# EasyEDA Pro project smartmp3.epro

# Schematic Schematic1
Board Name: Board1; Create Date: 2025-09-08; Page Name: P1; Project Name: SmartMP3; Schematic Name: Schematic1; Update Date: 2025-09-20; Company: EasyEDA.com; Page Size: A4; Version: V1.0
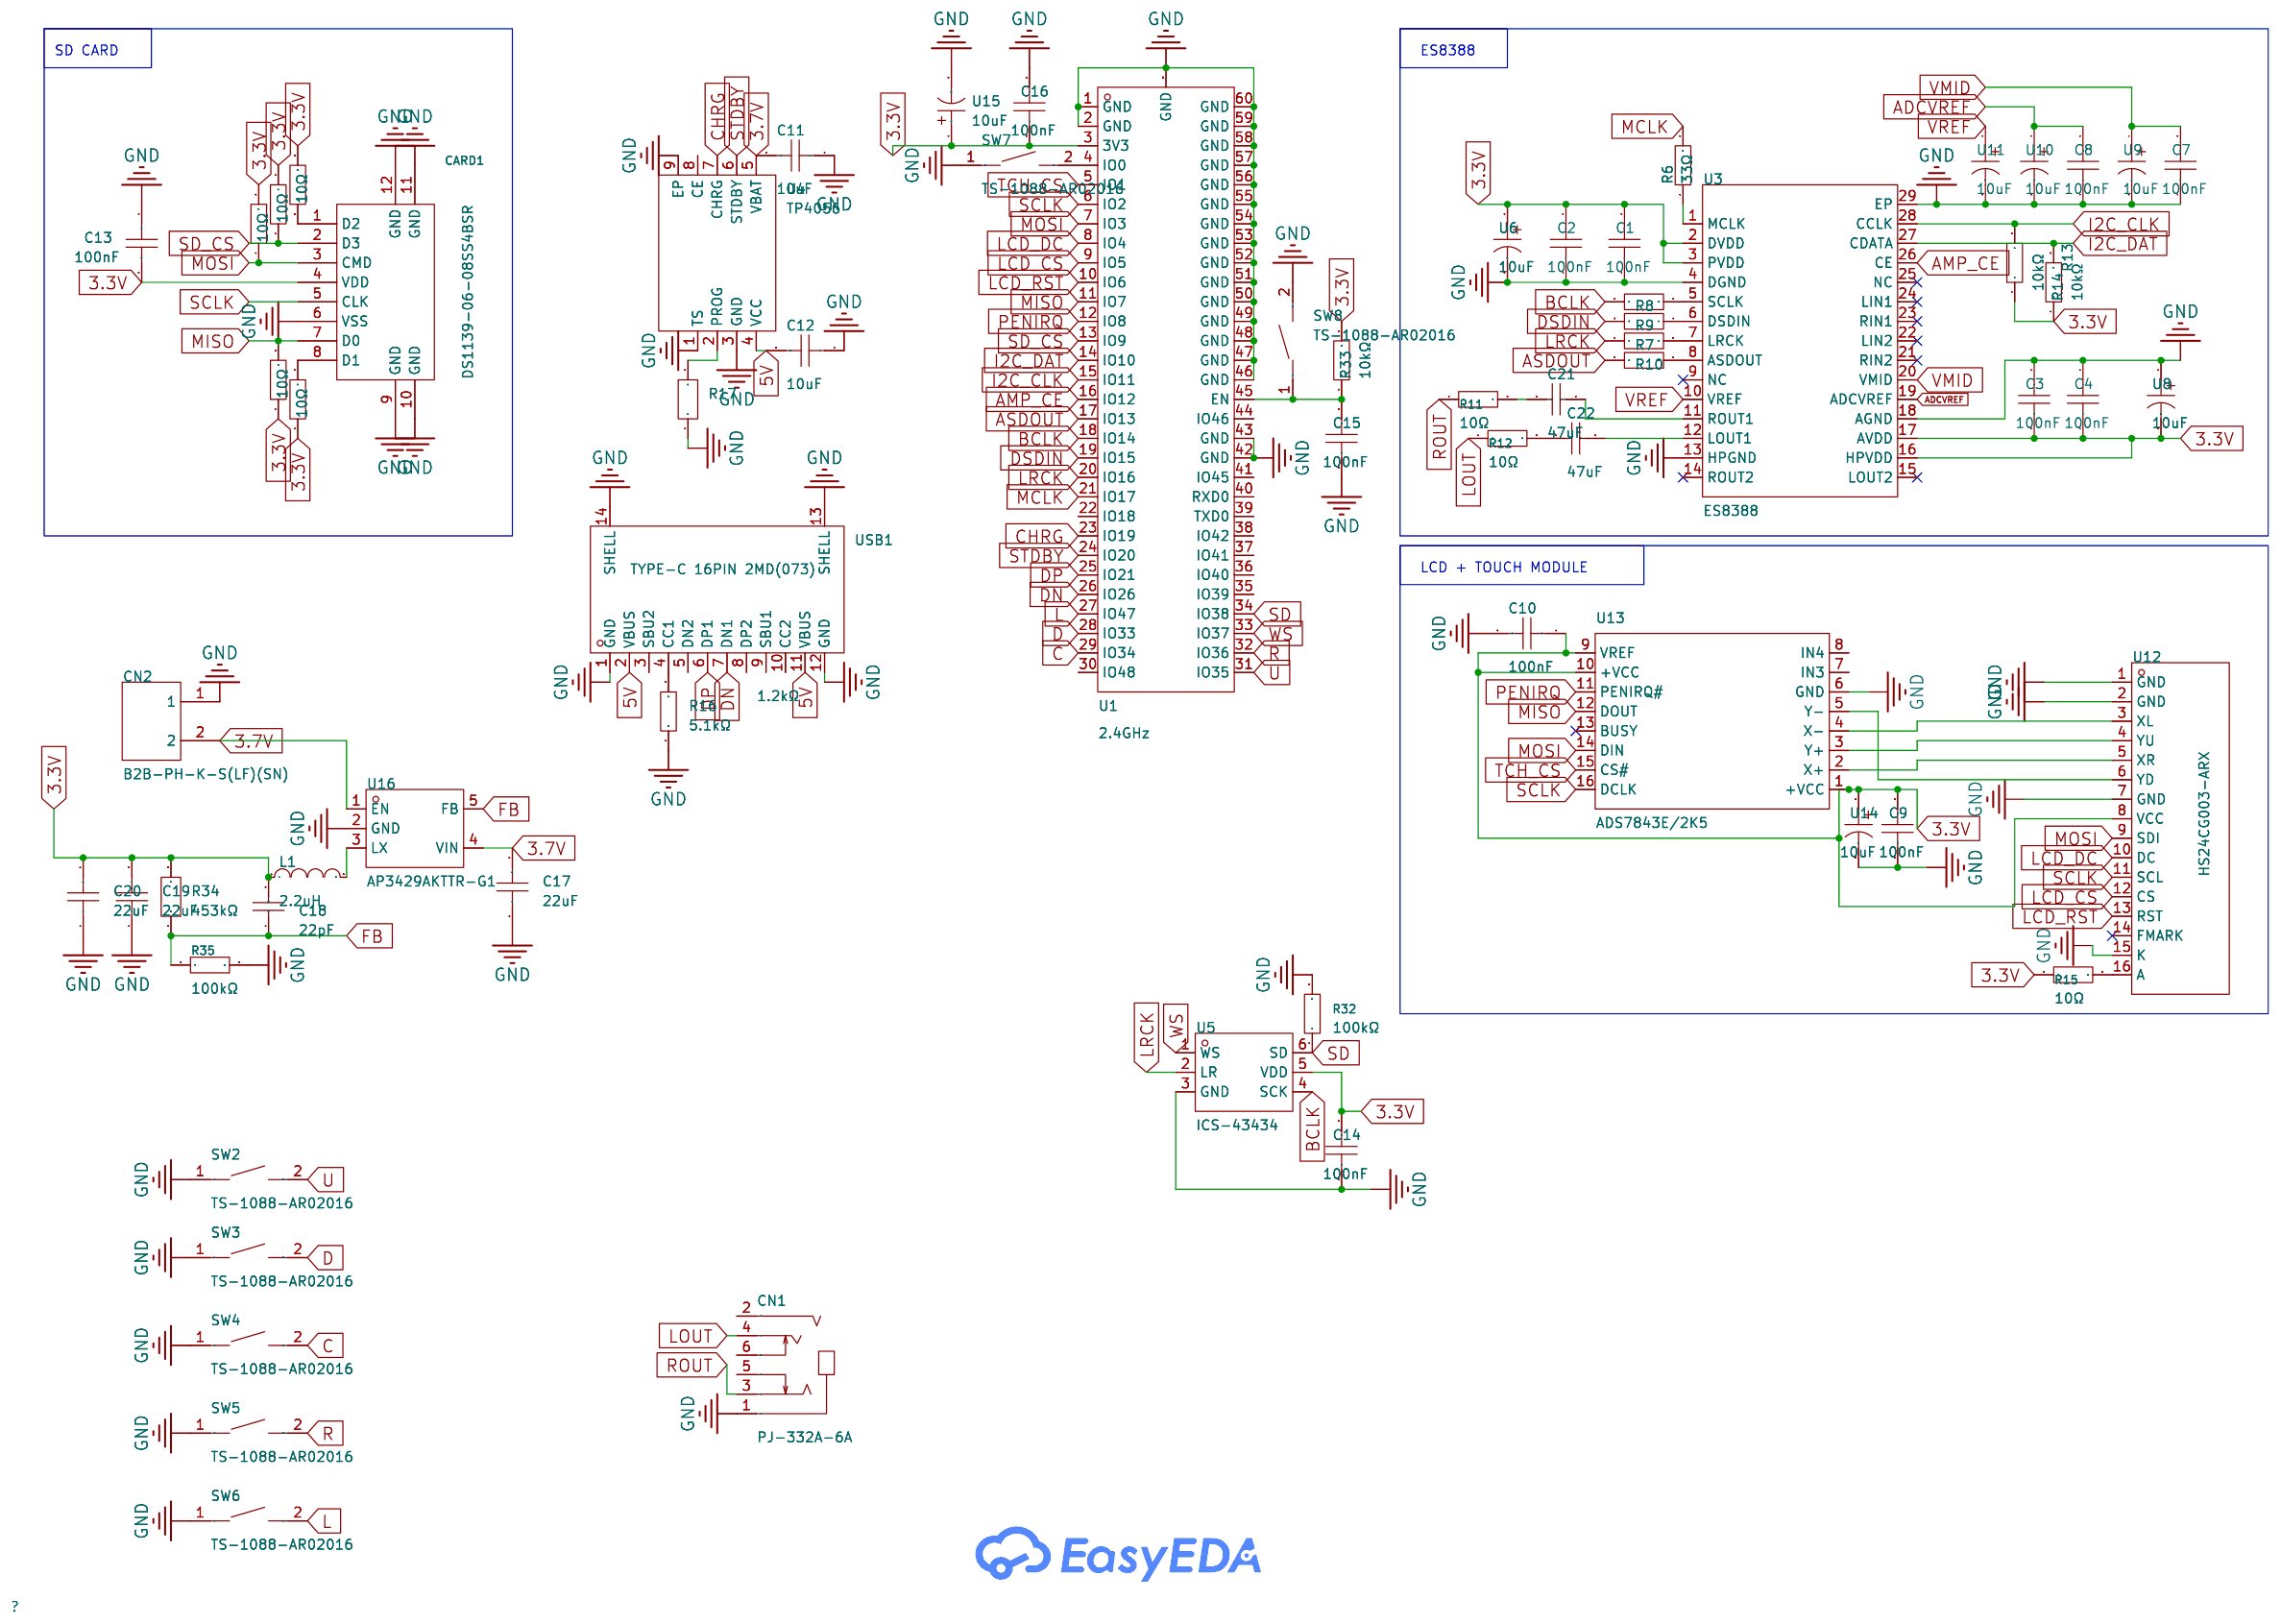
[diagram p0: schematic sheet]

## Parts
C1  100nF  [C0402]
C2  100nF  [C0402]
C3  100nF  [C0402]
C4  100nF  [C0402]
C7  100nF  [C0402]
C8  100nF  [C0402]
C9  100nF  [C0402]
C10  100nF  [C0402]
C11  10uF  [C0805]
C12  10uF  [C0805]
C13  100nF  [C0402]
C14  100nF  [C0402]
C15  100nF  [C0402]
C16  100nF  [C0402]
C17  22uF  [C0805]
C18  22pF  [C0603]
C19  22uF  [C0805]
C20  22uF  [C0805]
C21  47uF  [C0805]
C22  47uF  [C0805]
CARD1  DS1139-06-08SS4BSR  [TF-SMD_DS1139-06-08SS4BSR]
CN1  PJ-332A-6A  [AUDIO-SMD_PJ-332A-6A]
CN2  B2B-PH-K-S(LF)(SN)  [CONN-TH_B2B-PH-K-S]
L1  2.2uH  [L1008]
R6  33Ω  [R0402]
R7  33Ω  [R0402]
R8  33Ω  [R0402]
R9  33Ω  [R0402]
R10  33Ω  [R0402]
R11  10Ω  [R0805_NEW]
R12  10Ω  [R0805_NEW]
R13  10kΩ  [R0603]
R14  10kΩ  [R0603]
R15  10Ω  [R0805_NEW]
R16  5.1kΩ  [R0603]
R17  1.2kΩ  [R1206]
R18  10Ω  [R0805_NEW]
R19  10Ω  [R0805_NEW]
R20  10Ω  [R0805_NEW]
R22  10Ω  [R0805_NEW]
R23  10Ω  [R0805_NEW]
R32  100kΩ  [R0603]
R33  10kΩ  [R0603]
R34  453kΩ  [R0603]
R35  100kΩ  [R0603]
SW2  TS-1088-AR02016  [SW-SMD_L3.9-W3.0-P4.45]
SW3  TS-1088-AR02016  [SW-SMD_L3.9-W3.0-P4.45]
SW4  TS-1088-AR02016  [SW-SMD_L3.9-W3.0-P4.45]
SW5  TS-1088-AR02016  [SW-SMD_L3.9-W3.0-P4.45]
SW6  TS-1088-AR02016  [SW-SMD_L3.9-W3.0-P4.45]
SW7  TS-1088-AR02016  [SW-SMD_L3.9-W3.0-P4.45]
SW8  TS-1088-AR02016  [SW-SMD_L3.9-W3.0-P4.45]
U1  2.4GHz  [BULETM-SMD_ESP32-S3-MINI-1-N8]
U3  ES8388  [QFN-28_L4.0-W4.0-P0.45-BL-EP]
U4  TP4056  [ESOP-8_L4.9-W3.9-P1.27-LS6.0-BL-EP]
U5  ICS-43434  [MIC-SMD_6P-L3.5-W2.7-P0.90-BL]
U6  10uF  [CAP-SMD_BD4.0-L4.3-W4.3-LS5.0-FD]
U8  10uF  [CAP-SMD_BD4.0-L4.3-W4.3-LS5.0-FD]
U9  10uF  [CAP-SMD_BD4.0-L4.3-W4.3-LS5.0-FD]
U10  10uF  [CAP-SMD_BD4.0-L4.3-W4.3-LS5.0-FD]
U11  10uF  [CAP-SMD_BD4.0-L4.3-W4.3-LS5.0-FD]
U12  HS24CG003-ARX  [LCD-SMD_HS24CG003-ARX]
U13  ADS7843E/2K5  [SSOP-16_L4.9-W3.9-P0.64-LS6.0-BL-1]
U14  10uF  [CAP-SMD_BD4.0-L4.3-W4.3-LS5.0-FD]
U15  10uF  [CAP-SMD_BD4.0-L4.3-W4.3-LS5.0-FD]
U16  AP3429AKTTR-G1  [TSOT-23-5_L2.9-W1.6-P0.95-LS2.8-BR]
USB1  TYPE-C 16PIN 2MD(073)  [USB-C-SMD_TYPE-C-6PIN-2MD-073]

## Library data of the parts
C1-C4 C7-C10 C13-C16 = CT41G-0402-2X1-16V-0.1μF-K(N): Capacitance:100nF Tolerance:±10% Tolerance:±10% Voltage Rating:16V Temperature Coefficient:-; LCSC Part Name: 100nF ±10% 16V; Supplier Part: C141382; Manufacturer: TORCH(火炬); Supplier Footprint: 0402; JLCPCB Part Class: Extended Part; Datasheet: https://item.szlcsc.com/datasheet/CT41G-0402-2X1-16V-0.1%25CE%25BCF-K(N)/152712.html; Supplier: LCSC; Tolerance: ±10%; Voltage Rating: 16V
C11 C12 = CL21A106KAYNNNE_C15850: Capacitance:10uF Tolerance:±10% Tolerance:±10% Voltage Rating:25V Temperature Coefficient:X5R; LCSC Part Name: 10uF ±10% 25V; Supplier Part: C15850; Manufacturer: SAMSUNG(三星); Manufacturer Part: CL21A106KAYNNNE; Supplier Footprint: 0805; JLCPCB Part Class: Basic Part; Datasheet: https://item.szlcsc.com/datasheet/CL21A106KAYNNNE/16532.html; Supplier: LCSC; Tolerance: ±10%; Voltage Rating: 25V; Temperature Coefficient: X5R
C17 C19 C20 = CL21A226MAYNNNE: Capacitance:22uF Tolerance:±20% Tolerance:±20% Voltage Rating:25V Temperature Coefficient:X5R; LCSC Part Name: 22uF ±20% 25V; Supplier Part: C602037; Manufacturer: SAMSUNG(三星); Supplier Footprint: 0805; JLCPCB Part Class: Extended Part; Datasheet: https://item.szlcsc.com/datasheet/CL21A226MAYNNNE/631473.html; Supplier: LCSC; Tolerance: ±20%; Voltage Rating: 25V; Temperature Coefficient: X5R
C18 = CL10C220JB8NNNC: Capacitance:22pF Tolerance:±5% Tolerance:±5% Voltage Rating:50V Temperature Coefficient:C0G; LCSC Part Name: 22pF ±5% 50V; Supplier Part: C1653; Manufacturer: SAMSUNG(三星); Supplier Footprint: 0603; JLCPCB Part Class: Basic Part; Datasheet: https://item.szlcsc.com/datasheet/CL10C220JB8NNNC/2005.html; Supplier: LCSC; Tolerance: ±5%; Voltage Rating: 50V; Temperature Coefficient: C0G
C21 C22 = CL21A476MQYNNNE: Capacitance:47uF Tolerance:±20% Tolerance:±20% Voltage Rating:6.3V Temperature Coefficient:X5R; LCSC Part Name: 47uF ±20% 6.3V; Supplier Part: C16780; Manufacturer: SAMSUNG(三星); Supplier Footprint: 0805; JLCPCB Part Class: Basic Part; Datasheet: https://item.szlcsc.com/datasheet/CL21A476MQYNNNE/17464.html; Supplier: LCSC; Tolerance: ±20%; Voltage Rating: 6.3V; Temperature Coefficient: X5R
CARD1 = DS1139-06-08SS4BSR: Card Connection Mode:Clamshell Card Type:MicroSD卡(TF卡) Connector Type:Deck Maximum Body Height:- Contact Material:- Contact Plating:- Operating Temperature Range:- Operating Temperature Range:- Soldering Temperature(Max):-; LCSC Part Name: 翻盖式 MicroSD卡(TF卡) 卡座; Supplier Part: C86574; Manufacturer: CONNFLY; Supplier Footprint: SMD; JLCPCB Part Class: Extended Part; Datasheet: https://atta.szlcsc.com/upload/public/pdf/source/20161105/1478330339773.pdf; Supplier: LCSC; Card Connection Mode: Clamshell; Card Type: MicroSD卡(TF卡); Connector Type: Deck
CN1 = PJ-332A-6A: Connector Type:3.5mm Headphone Jack Current Rating:1A Voltage Rating (Max):30V Operating Temperature:-25℃~+80℃ Operating Temperature:-25℃~+80℃; LCSC Part Name: 3.5mm耳机座; Supplier Part: C2848643; Manufacturer: 韩国韩荣; Supplier Footprint: SMD; JLCPCB Part Class: Extended Part; Datasheet: https://item.szlcsc.com/datasheet/PJ-332A-6A/3047164.html; Supplier: LCSC; Connector Type: 3.5mm Headphone Jack; Current Rating: 1A; Voltage Rating (Max): 30V; Operating Temperature: -25℃~+80℃
CN2 = B2B-PH-K-S(LF)(SN): Pins Structure:1x2P Pitch:2mm Mounting Type:Direct Insert Reference Series:PH Number of Pins:2P Number of Rows:1 Number of PINs Per Row:2 Row Spacing:- Current Rating:2A Contact Material:Brass Contact Plating:Tin Operating Temperature:-25℃~+85℃ Operating; LCSC Part Name: 1x2P 间距:2mm 直插 系列:PH; Supplier Part: C131337; Manufacturer: JST; Supplier Footprint: 插件,P=2mm; JLCPCB Part Class: Extended Part; Datasheet: https://atta.szlcsc.com/upload/public/pdf/source/20171026/C131342_15089839687311058815.pdf; Supplier: LCSC; Pins Structure: 1x2P; Pitch: 2mm; Mounting Type: Direct Insert; Reference Series: PH; Number of Pins: 2P; Number of Rows: 1; Number of PINs Per Row: 2; Current Rating: 2A; Contact Material: Brass; Contact Plating: Tin; Operating Temperature: -25℃~+85℃; Voltage Rating: 100V; Plastic Material: PA66; Flame Retardant Rating: UL94V-0; Supplementary Features: K-leg punch; Color: White; Z-Height of the Board: 6mm; X-Length of Bottom Edge on Board (Spacing Line): 5.9mm; Y-Width of Bottom Edge on Board: 4.5mm
L1 = LQM2HPN2R2MG0L: Inductance:2.2uH Tolerance:±20% Tolerance:±20% Current Rating:1.3A Current - Saturation (Isat):- DC Resistance(DCR):100mΩ Q @ Frequency:- Frequency - Self Resonant:40MHz Ratings:-; LCSC Part Name: 2.2uH ±20%; Supplier Part: C86092; Manufacturer: muRata(村田); Supplier Footprint: 1008; JLCPCB Part Class: Extended Part; Datasheet: https://item.szlcsc.com/datasheet/LQM2HPN2R2MG0L/87268.html; Supplier: LCSC; Tolerance: ±20%; Current Rating: 1.3A; DC Resistance(DCR): 100mΩ; Frequency - Self Resonant: 40MHz
R6-R10 = RC0402FR-0733RL: Type:Thick Film Resistor Resistance:33Ω Tolerance:±1% Tolerance:±1% Power(Watts):62.5mW Voltage-Supply(Max):50V Temperature Coefficient:±100ppm/℃ Temperature Coefficient:±100ppm/℃ Operating Temperature:-55℃~+155℃ Operating Temperature:-55℃~+155℃; LCSC Part Name: 厚膜电阻 33Ω ±1% 62.5mW; Supplier Part: C138002; Manufacturer: YAGEO(国巨); Supplier Footprint: 0402; JLCPCB Part Class: Extended Part; Datasheet: https://atta.szlcsc.com/upload/public/pdf/source/20250610/89E4D743C004A82A45145C7A2CC3A578.pdf; Supplier: LCSC; Type: Thick Film Resistor; Tolerance: ±1%; Power(Watts): 62.5mW; Voltage-Supply(Max): 50V; Temperature Coefficient: ±100ppm/℃; Operating Temperature: -55℃~+155℃
R11 R12 R15 R18-R20 R22 R23 = 0805W8F100JT5E: Type:Thick Film Resistor Resistance:10Ω Tolerance:±1% Tolerance:±1% Power(Watts):125mW Voltage-Supply(Max):150V Temperature Coefficient:±200ppm/℃ Temperature Coefficient:±200ppm/℃ Operating Temperature:-55℃~+155℃ Operating Temperature:-55℃~+155℃; LCSC Part Name: 10Ω ±1% 125mW 厚膜电阻; Supplier Part: C17415; Manufacturer: UNI-ROYAL(厚声); Supplier Footprint: 0805; JLCPCB Part Class: Basic Part; Datasheet: https://item.szlcsc.com/datasheet/0805W8F100JT5E/18103.html; Supplier: LCSC; Type: Thick Film Resistor; Tolerance: ±1%; Power(Watts): 125mW; Voltage-Supply(Max): 150V; Temperature Coefficient: ±200ppm/℃; Operating Temperature: -55℃~+155℃
R13 R14 R33 = RC0603FR-0710KL: Type:Thick Film Resistors Resistance: Tolerance:±1% Tolerance:±1% Power(Watts): Overload Voltage (Max): Temperature Coefficient:±100ppm/℃ Temperature Coefficient:±100ppm/℃ Operating Temperature Range:-55℃~+155℃ Operating Temperature Range:-55℃~+155℃; LCSC Part Name: 厚膜电阻 10kΩ ±1% 100mW; Supplier Part: C98220; Manufacturer: YAGEO(国巨); Supplier Footprint: 0603; JLCPCB Part Class: Extended Part; Datasheet: https://atta.szlcsc.com/upload/public/pdf/source/20180927/C295883_E8D83085EA81BD7DE0B2B681138C15EE.pdf; Supplier: LCSC; Type: Thick Film Resistors; Tolerance: ±1%; Temperature Coefficient: ±100ppm/℃; Operating Temperature Range: -55℃~+155℃
R16 = RC0603FR-075K1L: Type:Thick Film Resistors Resistance:5.1kΩ Tolerance:±1% Tolerance:±1% Power(Watts):100mW Voltage-Supply(Max):75V Temperature Coefficient:±100ppm/℃ Temperature Coefficient:±100ppm/℃ Operating Temperature:-55℃~+155℃ Operating Temperature:-55℃~+155℃; LCSC Part Name: 厚膜电阻 5.1kΩ ±1% 100mW; Supplier Part: C105580; Manufacturer: YAGEO(国巨); Supplier Footprint: 0603; JLCPCB Part Class: Extended Part; Datasheet: https://atta.szlcsc.com/upload/public/pdf/source/20180316/70C0E2BDAE7FCC62C531A5A58D202EE1.pdf; Supplier: LCSC; Type: Thick Film Resistors; Tolerance: ±1%; Power(Watts): 100mW; Voltage-Supply(Max): 75V; Temperature Coefficient: ±100ppm/℃; Operating Temperature: -55℃~+155℃
R17 = FRC1206J122 TS: Type:Thick Film Resistor Resistance:1.2kΩ Tolerance:±5% Tolerance:±5% Power(Watts):250mW Voltage-Supply(Max):200V Temperature Coefficient:±100ppm/℃ Temperature Coefficient:±100ppm/℃ Operating Temperature:-55℃~+155℃ Operating Temperature:-55℃~+155℃; LCSC Part Name: 1.2kΩ ±5% 250mW 厚膜电阻; Supplier Part: C2907408; Manufacturer: FOJAN(富捷); Supplier Footprint: 1206; JLCPCB Part Class: Extended Part; Supplier: LCSC; Type: Thick Film Resistor; Tolerance: ±5%; Power(Watts): 250mW; Voltage-Supply(Max): 200V; Temperature Coefficient: ±100ppm/℃; Operating Temperature: -55℃~+155℃
R32 R35 = RC0603FR-07100KL: Type:Thick Film Resistors Resistance: Tolerance:±1% Tolerance:±1% Power(Watts): Overload Voltage (Max): Temperature Coefficient:±100ppm/℃ Temperature Coefficient:±100ppm/℃ Operating Temperature Range:-55℃~+155℃ Operating Temperature Range:-55℃~+155℃; LCSC Part Name: 厚膜电阻 100kΩ ±1% 100mW; Supplier Part: C14675; Manufacturer: YAGEO(国巨); Supplier Footprint: 0603; JLCPCB Part Class: Extended Part; Datasheet: https://atta.szlcsc.com/upload/public/pdf/source/20140324/1457707028752.pdf; Supplier: LCSC; Type: Thick Film Resistors; Tolerance: ±1%; Temperature Coefficient: ±100ppm/℃; Operating Temperature Range: -55℃~+155℃
R34 = FRC0603F4533TS: Type:Thick Film Resistor Resistance:453kΩ Tolerance:±1% Tolerance:±1% Power(Watts):100mW Voltage-Supply(Max):75V Temperature Coefficient:±100ppm/℃ Temperature Coefficient:±100ppm/℃ Operating Temperature:-55℃~+155℃ Operating Temperature:-55℃~+155℃; LCSC Part Name: 453kΩ ±1% 100mW 厚膜电阻; Supplier Part: C3013202; Manufacturer: FOJAN(富捷); Supplier Footprint: 0603; JLCPCB Part Class: Extended Part; Supplier: LCSC; Type: Thick Film Resistor; Tolerance: ±1%; Power(Watts): 100mW; Voltage-Supply(Max): 75V; Temperature Coefficient: ±100ppm/℃; Operating Temperature: -55℃~+155℃
SW2-SW8 = TS-1088-AR02016: Circuit:SPST Actuator Style:Round Button Operating Force:1.6N Mounting Type:Surface Mount,Vertical Length:4mm Width:3mm Switch Height:2mm with Bracket:Without Bracket Contact Current:50mA Voltage Rating:12V Actuator/Cap Color:Black Termination Style:SMD(S; LCSC Part Name: 4*3*2mm 立贴 轻触开关; Supplier Part: C720477; Manufacturer: XUNPU(讯普); Supplier Footprint: SMD; JLCPCB Part Class: Basic Part; Datasheet: https://item.szlcsc.com/datasheet/TS-1088-AR02016/763484.html; Supplier: LCSC; Circuit: SPST; Actuator Style: Round Button; Operating Force: 1.6N; Mounting Type: Surface Mount,Vertical; Length: 4mm; Width: 3mm; Switch Height: 2mm; with Bracket: Without Bracket; Contact Current: 50mA; Voltage Rating: 12V; Actuator/Cap Color: Black; Termination Style: SMD(SMT) Tab; Life: 100,000 Cycles; Operating Temperature: -30℃~+80℃
U1 = ESP32-S3-MINI-1-N8: Core Processor:ESP32-S3FN8 Chip Wireless Standard:- Support Interface:I2C；GPIO；SPI；PWM；ADC；UART；USB；I2S Frequency:2.4GHz Antenna Type:- Output Power:20.5dBm Output Power:20.5dBm Operating Voltage:- Operating Voltage:- Receive  Current:- Send  Current:- Se; Supplier Part: C2913206; Manufacturer: ESPRESSIF(乐鑫); Supplier Footprint: SMD; JLCPCB Part Class: Extended Part; Datasheet: https://atta.szlcsc.com/upload/public/pdf/source/20220425/7F117D7A09F85946280540FD9EFDF9F3.pdf; Supplier: LCSC; Core Processor: ESP32-S3FN8 Chip; Support Interface: I2C；GPIO；SPI；PWM；ADC；UART；USB；I2S; Output Power: 20.5dBm
U3 = ES8388: Voltage - Supply:1.7V~3.6V Voltage - Supply:1.7V~3.6V Interface Type:SPI；I2C; LCSC Part Name: 音频解码芯片; Supplier Part: C365736; Manufacturer: Everest-semi(顺芯); Supplier Footprint: QFN-28-EP(4x4); JLCPCB Part Class: Extended Part; Datasheet: https://item.szlcsc.com/datasheet/ES8388/339918.html; Supplier: LCSC; Voltage - Supply: 1.7V~3.6V; Interface Type: SPI；I2C
U4 = TP4056_C22470410: The Chip Type:Linear charging chip Voltage - Supply:4.5V~5.5V Voltage - Supply:4.5V~5.5V Charge Current - Max:1000mA Charging Saturation Voltage:4.2V End-Off Voltage:- Type of Battery:Lithium-ion/Polymer Number of Cells:1 Number of Cells:1 Operating Tempe; Supplier Part: C22470410; Manufacturer: JSMSEMI(杰盛微); Supplier Footprint: ESOP-8; JLCPCB Part Class: Extended Part; Datasheet: https://atta.szlcsc.com/upload/public/pdf/source/20240625/CEC2C0E539B944633666A6FB842D3E54.pdf; Supplier: LCSC; The Chip Type: Linear charging chip; Voltage - Supply: 4.5V~5.5V; Charge Current - Max: 1000mA; Charging Saturation Voltage: 4.2V; Type of Battery: Lithium-ion/Polymer; Number of Cells: 1; Operating Temperature: -40℃~+85℃
U5 = ICS-43434_C5656610: Direction:Omnidirectional Voltage - Supply:1.65V~3.63V Voltage - Supply:1.65V~3.63V Current Consumption:550uA Current Consumption:550uA S/N Ratio:64dB Sensitivity:- Sensitivity:-; Supplier Part: C5656610; Manufacturer: TDK InvenSense(应美盛); JLCPCB Part Class: Extended Part; Datasheet: https://item.szlcsc.com/datasheet/ICS-43434/6577565.html; Supplier: LCSC; Direction: Omnidirectional; Voltage - Supply: 1.65V~3.63V; Current Consumption: 550uA; S/N Ratio: 64dB
U6 U8-U11 U14 U15 = RST10UF35V015: Capacitance:10uF Tolerance:±20% Tolerance:±20% Voltage Rating:35V Ripple Current:15mA@120Hz Equivalent Series Resistance(ESR):- Diameter:4mm Height - Seated (Max):5.4mm Lifetime:2000hrs@105℃ Operating Temperature:-40℃~+105℃ Operating Temperature:-40℃~+105; LCSC Part Name: 10uF ±20% 35V; Supplier Part: C4747970; Manufacturer: KNSCHA(科尼盛); Supplier Footprint: SMD,D4xL5.4mm; JLCPCB Part Class: Extended Part; Datasheet: https://atta.szlcsc.com/upload/public/pdf/source/20220722/B4E523E3F12606FCEEF875CFA41EF963.pdf; Supplier: LCSC; Tolerance: ±20%; Voltage Rating: 35V; Ripple Current: 15mA@120Hz; Diameter: 4mm; Height - Seated (Max): 5.4mm; Lifetime: 2000hrs@105℃; Operating Temperature: -40℃~+105℃
U12 = HS24CG003-ARX: Controller Type:ST7789 Size:2.4 Dot Pixels:320x240 Operating Temperature:-20℃~+70℃ Operating Temperature:-20℃~+70℃; LCSC Part Name: 2.4寸240*320(RGB)彩色SPI串口TFT液晶显示屏; Supplier Part: C5329583; Manufacturer: HS(汉昇); JLCPCB Part Class: Extended Part; Datasheet: https://atta.szlcsc.com/upload/public/pdf/source/20240419/92734CF61D9EC5DBF692D2DF9BCAC008.pdf; Supplier: LCSC; Controller Type: ST7789; Size: 2.4; Dot Pixels: 320x240; Operating Temperature: -20℃~+70℃
U13 = ADS7843E/2K5: Touch Screen Type:4 Wire Resistive Type Resolution (Bits):12Bit Interface:SPI Gain Error:±2LSB Gain Error:±2LSB Voltage - Supply:2.7V~5V Voltage - Supply:2.7V~5V Throughput Rate:125kHz Operating Temperature:-40℃~+85℃ Operating Temperature:-40℃~+85℃; LCSC Part Name: ADS7843 触摸屏控制器; Supplier Part: C364888; Manufacturer: TI(德州仪器); Supplier Footprint: SSOP-16-150mil; JLCPCB Part Class: Extended Part; Datasheet: https://www.ti.com/cn/lit/gpn/ads7843; Supplier: LCSC; Touch Screen Type: 4 Wire Resistive Type; Resolution (Bits): 12Bit; Interface: SPI; Gain Error: ±2LSB; Voltage - Supply: 2.7V~5V; Throughput Rate: 125kHz; Operating Temperature: -40℃~+85℃
U16 = AP3429AKTTR-G1: Function:Step-down type Output Type:Adjustable Input Voltage:2.7V~5.5V Input Voltage:2.7V~5.5V Output Voltage:- Output Voltage:- Output Current:2A Switching Frequency:1MHz Switching Frequency:1MHz Operating Temperature:-40℃~+85℃ Operating Temperature:-40℃; LCSC Part Name: 1.0MHz, 2A 降压 DC-DC 转换器; Supplier Part: C441814; Manufacturer: DIODES(美台); Supplier Footprint: TSOT-25-5; JLCPCB Part Class: Extended Part; Datasheet: https://atta.szlcsc.com/upload/public/pdf/source/20191028/C441814_E5644AF8F55DD7901E677693E39C2B16.pdf; Supplier: LCSC; Function: Step-down type; Output Type: Adjustable; Input Voltage: 2.7V~5.5V; Output Current: 2A; Switching Frequency: 1MHz; Operating Temperature: -40℃~+85℃; Synchronous Rectification: Yes; Number of Outputs: 1; Topology: Step-down; Quiescent Current (Iq): 90uA; Switch tube (built-in/external): Built-in
USB1 = TYPE-C 16PIN 2MD(073): Connector Type:Type-C Protocol Standard:- Gender:Female Mounting Type:Surface Mount, Right Angle Number of Contacts:16P Number of Ports:1 Current Rating-Power:3A Voltage Rating:5V Connect-Disconnect Life:5,000 Cycles Supplementary Features:- Center Height; LCSC Part Name: Type-C 母 卧贴; Supplier Part: C2765186; Manufacturer: SHOU HAN(首韩); Supplier Footprint: SMD; JLCPCB Part Class: Extended Part; Datasheet: https://item.szlcsc.com/datasheet/TYPE-C%252016PIN%25202MD(073)/2901843.html; Supplier: LCSC; Connector Type: Type-C; Gender: Female; Mounting Type: Surface Mount, Right Angle; Number of Contacts: 16P; Number of Ports: 1; Current Rating-Power: 3A; Voltage Rating: 5V; Connect-Disconnect Life: 5,000 Cycles; Detection color: Black; Operating Temperature: -25℃~+85℃

## Nets
3.3V: C1.2 C2.2 C3.1 C4.1 C9.2 C10.1 C13.2 C14.2 C16.1 C18.2 C19.2 C20.2 CARD1.4(VDD) L1.1 R13.1 R14.1 R15.1 R18.2 R19.2 R20.2 R22.1 R23.1 R33.2 R34.2 U1.3(3V3) U3.2(DVDD) U3.3(PVDD) U3.16(HPVDD) U3.17(AVDD) U5.5(VDD) U6.1 U8.2 U12.8(VCC) U13.1(+VCC) U13.9(VREF) U13.10(+VCC) U14.1 U15.1
3.7V: C11.2 C17.2 CN2.2 U4.5(VBAT) U16.1(EN) U16.4(VIN)
5V: C12.2 U4.4(VCC) USB1.2(VBUS) USB1.11(VBUS)
GND: C1.1 C2.1 C3.2 C4.2 C7.1 C8.1 C9.1 C10.2 C11.1 C12.1 C13.1 C14.1 C15.1 C16.2 C17.1 C19.1 C20.1 CARD1.6(VSS) CARD1.9(GND) CARD1.10(GND) CARD1.11(GND) CARD1.12(GND) CN1.1 CN2.1 R16.1 R17.1 R32.2 R35.2 SW2.1 SW3.1 SW4.1 SW5.1 SW6.1 SW7.1 SW8.2 U1.1(GND) U1.2(GND) U1.42(GND) U1.43(GND) U1.46(GND) U1.47(GND) U1.48(GND) U1.49(GND) U1.50(GND) U1.51(GND) U1.52(GND) U1.53(GND) U1.54(GND) U1.55(GND) U1.56(GND) U1.57(GND) U1.58(GND) U1.59(GND) U1.60(GND) U1.GND U3.4(DGND) U3.13(HPGND) U3.18(AGND) U3.29(EP) U4.1(TS) U4.3(GND) U4.9(EP) U5.3(GND) U6.2 U8.1 U9.2 U10.2 U11.2 U12.1(GND) U12.2(GND) U12.7(GND) U12.15(K) U13.6(GND) U14.2 U15.2 U16.2(GND) USB1.1(GND) USB1.12(GND) USB1.13(SHELL) USB1.14(SHELL)
ADCVREF: C8.2 U3.19(ADCVREF) U10.1
AMP_CE: U1.16(IO12) U3.26(CE)
ASDOUT: R10.2 U1.17(IO13)
BCLK: R8.2 U1.18(IO14) U5.4(SCK)
C: SW4.2 U1.29(IO34)
CHRG: U1.23(IO19) U4.7(CHRG)
D: SW3.2 U1.28(IO33)
DN: U1.26(IO26) USB1.7(DN1)
DP: U1.25(IO21) USB1.6(DP1)
DSDIN: R9.2 U1.19(IO15)
FB: C18.1 R34.1 R35.1 U16.5(FB)
I2C_CLK: R13.2 U1.15(IO11) U3.28(CCLK)
I2C_DAT: R14.2 U1.14(IO10) U3.27(CDATA)
L: SW6.2 U1.27(IO47)
LCD_CS: U1.9(IO5) U12.12(CS)
LCD_DC: U1.8(IO4) U12.10(DC)
LCD_RST: U1.10(IO6) U12.13(RST)
LOUT: CN1.4 R12.1
LRCK: R7.1 U1.20(IO16) U5.2(LR)
MCLK: R6.2 U1.21(IO17)
MISO: CARD1.7(D0) R22.2 U1.11(IO7) U13.12(DOUT)
MOSI: CARD1.3(CMD) R18.1 U1.7(IO3) U12.9(SDI) U13.14(DIN)
PENIRQ: U1.12(IO8) U13.11(PENIRQ#)
R: SW5.2 U1.32(IO36)
ROUT: CN1.3 R11.1
SCLK: CARD1.5(CLK) U1.6(IO2) U12.11(SCL) U13.16(DCLK)
SD: R32.1 U1.34(IO38) U5.6(SD)
SD_CS: CARD1.2(D3) R19.1 U1.13(IO9)
STDBY: U1.24(IO20) U4.6(STDBY)
TCH_CS: U1.5(IO1) U13.15(CS#)
U: SW2.2 U1.31(IO35)
VMID: C7.2 U3.20(VMID) U9.1
VREF: U3.10(VREF) U11.1
WS: U1.33(IO37) U5.1(WS)
$1N3464: R6.1 U3.1(MCLK)
$1N3611: R7.2 U3.7(LRCK)
$1N3650: R8.1 U3.5(SCLK)
$1N3734: R9.1 U3.6(DSDIN)
$1N3736: R10.1 U3.8(ASDOUT)
$1N3967: C21.2 U3.11(ROUT1)
$1N4008: C22.2 U3.12(LOUT1)
$1N4170: C21.1 R11.2
$1N6804: U12.6(YD) U13.5(Y-)
$1N6810: U12.3(XL) U13.4(X-)
$1N6817: U12.4(YU) U13.3(Y+)
$1N6824: U12.5(XR) U13.2(X+)
$1N7337: R15.2 U12.16(A)
$1N7731: R16.2 USB1.4(CC1)
$1N8164: R17.2 U4.2(PROG)
$1N10270: CARD1.1(D2) R20.1
$1N10384: CARD1.8(D1) R23.2
$1N17107: L1.2 U16.3(LX)
$1N20602: C22.1 R12.2
Net-(C15-2): C15.2 R33.1 SW8.1 U1.45(EN)
Net-(SW7-2): SW7.2 U1.4(IO0)

Not connected (* = marked no-connect by the designer): CN1 2 5 6; U1 22(IO18) 30(IO48) 35(IO39) 36(IO40) 37(IO41) 38(IO42) 39(TXD0) 40(RXD0) 41(IO45) 44(IO46); U3 9(NC)* 14(ROUT2)* 15(LOUT2)* 21(RIN2)* 22(LIN2)* 23(RIN1)* 24(LIN1)* 25(NC)*; U4 8(CE); U12 14(FMARK)*; U13 7(IN3) 8(IN4) 13(BUSY)*; USB1 3(SBU2) 5(DN2) 8(DP2) 9(SBU1) 10(CC2)

## Notes on the sheet
- SD CARD
- ES8388
- LCD + TOUCH MODULE

# Board PCB1
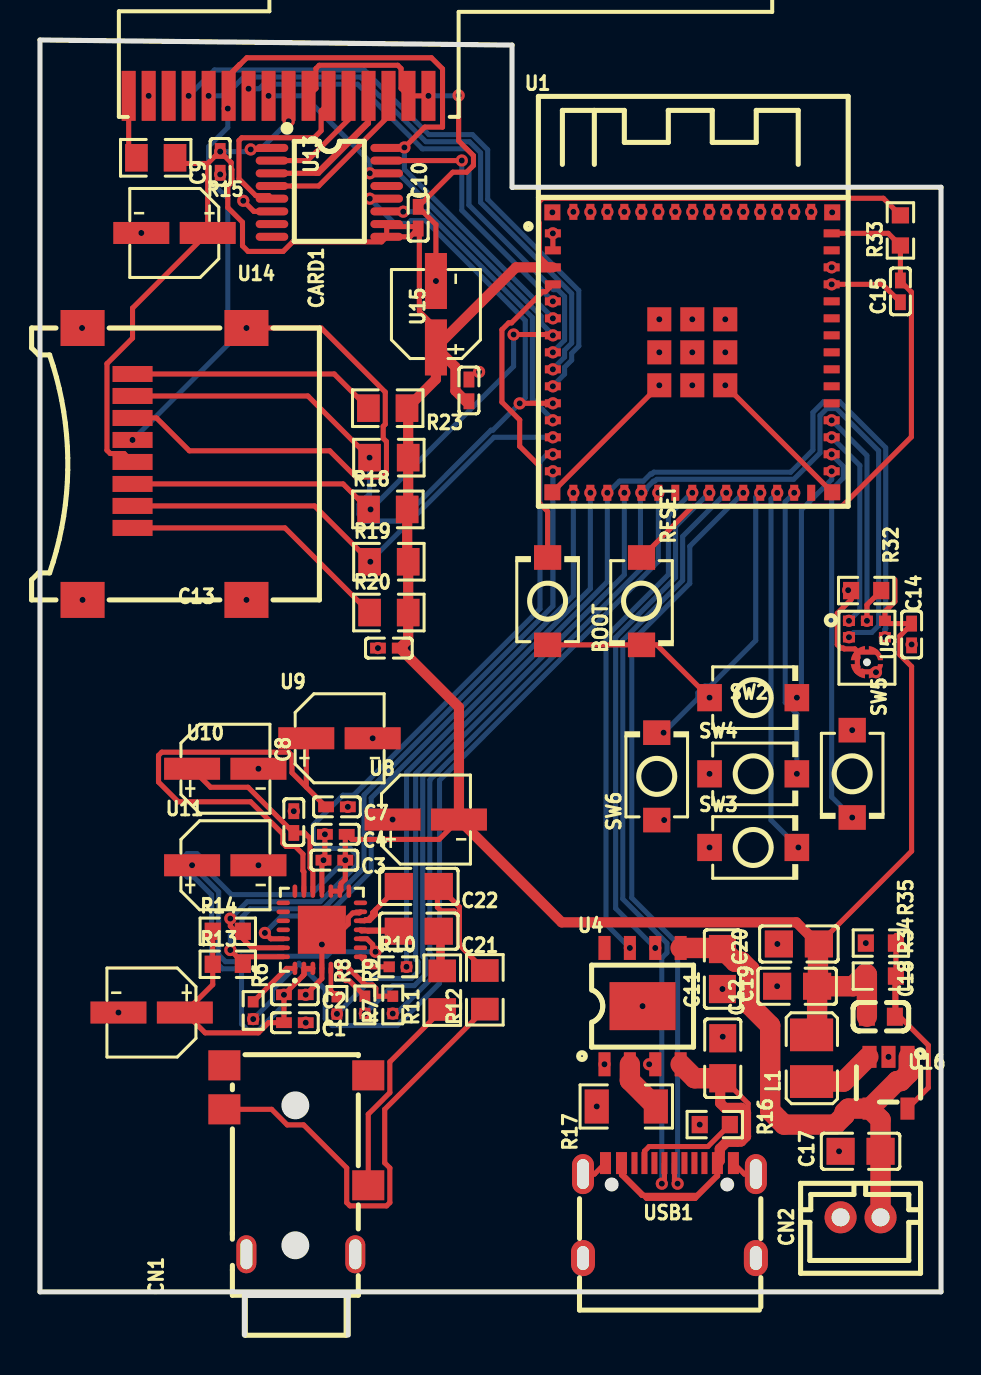
[diagram p1: board, top side]
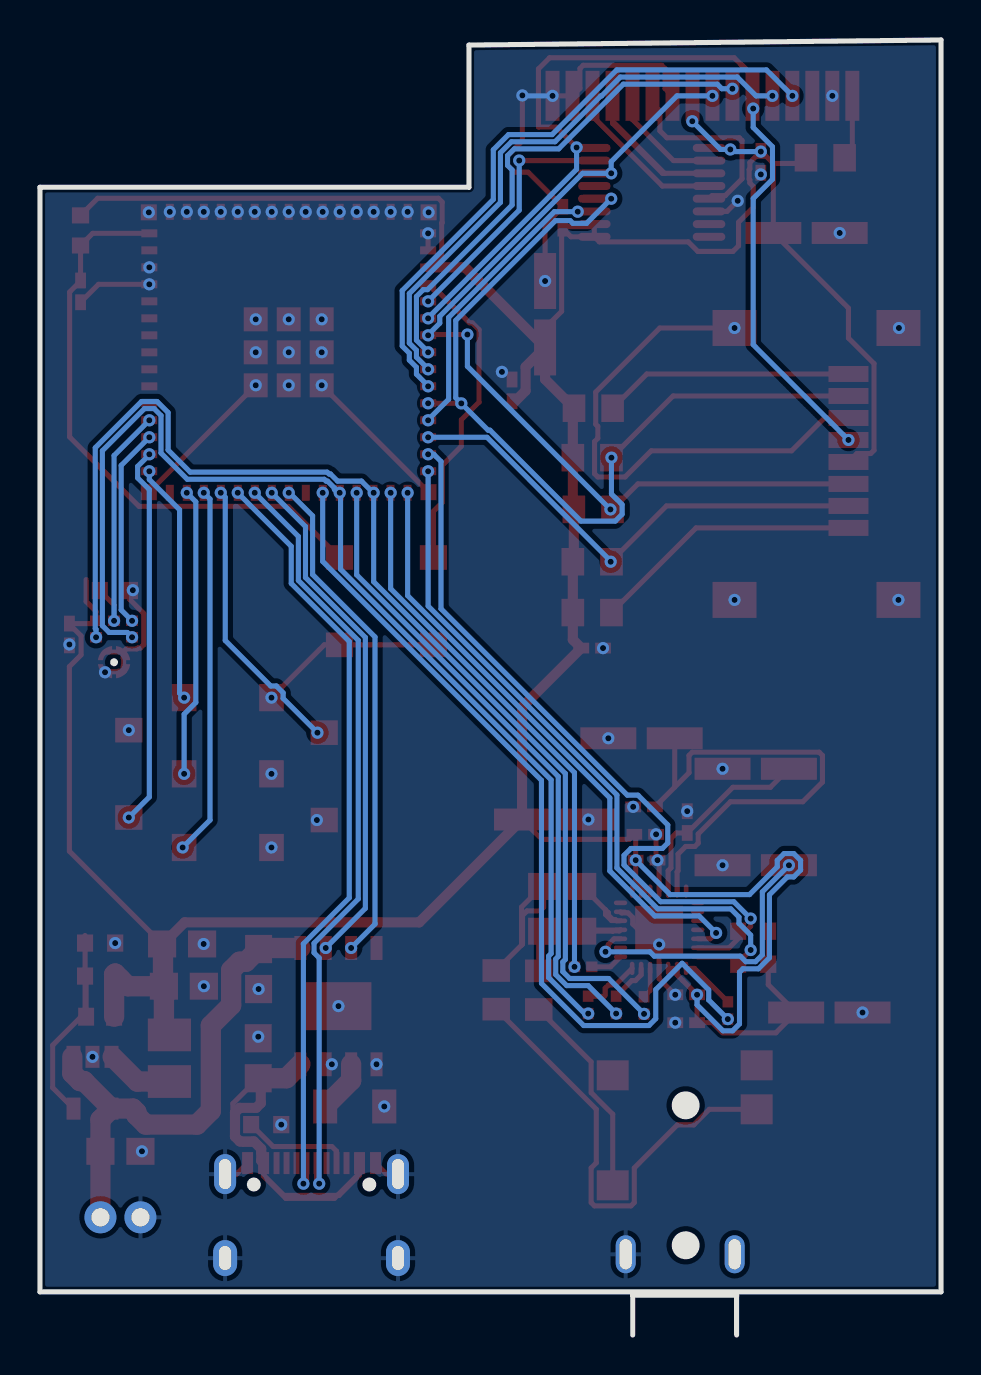
[diagram p2: board, bottom side, seen from below]

Outline 45.08 x 64.77 mm; copper layers: Top Layer, Bottom Layer. Coordinates in mm from the lower left corner of the outline.
Outline path: 0,64.77 0,2.16 45.08,2.16 45.08,57.4 23.62,57.4 23.62,64.52 0,64.77
Stack: Top Layer 0.035mm / Dielectric1 1.51mm FR4 er 4.5 / Bottom Layer 0.035mm

## Design rules (mm)
template: JLCPCB Capability(Two Layers Board)
spacing copperThickness1oz (default): track to track 0.102, other pairs 0.152 to 0.3
spacing copperThickness2oz: track to track 0.203, other pairs 0.152 to 0.3
track width copperThickness1oz (default): min 0.127, default 0.254, max 2.54
track width copperThickness2oz: min 0.203, default 0.254, max 2.54
differential pair differentialPair (default): width min 0.127, default 0.254, max 2.54; gap min 0.152, default 0.152
via viaSize (default): diameter min 0.5, default 0.61, max 10; hole min 0.3, default 0.305, max 6.3

## Placement (name value [footprint] x y rotation side)
BOOT  TS-1088-AR02016  [SW-SMD_L3.9-W3.0-P4.45]  25.4 36.7 90 top
C1  100nF  [C0402]  12.75 15.62 180 top
C2  100nF  [C0402]  12.75 17.02 180 top
C3  100nF  [C0402]  14.73 23.75 180 top
C4  100nF  [C0402]  14.8 25.04 180 top
C7  100nF  [C0402]  14.86 26.42 180 top
C8  100nF  [C0402]  12.7 25.65 270 top
C9  100nF  [C0402]  9.02 58.67 90 top
C10  100nF  [C0402]  18.92 55.88 90 top
C11  10uF  [C0805]  34.15 18.3 90 top
C12  10uF  [C0805]  34.16 13.84 270 top
C13  100nF  [C0402]  17.46 34.36 0 top
C14  100nF  [C0402]  43.61 35.04 90 top
C15  100nF  [C0402]  43.05 52.2 90 top
C16  100nF  [C0402]  21.46 47.24 90 top
C17  22uF  [C0805]  41.06 9.19 0 top
C18  22pF  [C0603]  42.08 15.92 180 top
C19  22uF  [C0805]  37.88 17.44 0 top
C20  22uF  [C0805]  37.97 19.56 0 top
C21  47uF  [C0805]  18.96 20.2 180 top
C22  47uF  [C0805]  18.96 22.43 180 top
CARD1  DS1139-06-08SS4BSR  [TF-SMD_DS1139-06-08SS4BSR]  6.23 43.57 270 top
CN1  PJ-332A-6A  [AUDIO-SMD_PJ-332A-6A]  12.83 8.76 90 top
CN2  B2B-PH-K-S(LF)(SN)  [CONN-TH_B2B-PH-K-S]  41.06 5.89 180 top
L1  2.2uH  [L1008]  38.61 13.84 270 top
R6  33Ω  [R0402]  10.67 16.23 270 top
R7  33Ω  [R0402]  17.65 16.51 90 top
R8  33Ω  [R0402]  14.86 16.49 270 top
R9  33Ω  [R0402]  16.26 16.51 270 top
R10  33Ω  [R0402]  17.91 18.41 0 top
R11  10Ω  [R0805_NEW]  20.13 17.25 90 top
R12  10Ω  [R0805_NEW]  22.26 17.26 90 top
R13  10kΩ  [R0603]  9.4 18.54 0 top
R14  10kΩ  [R0603]  9.4 20.19 0 top
R15  10Ω  [R0805_NEW]  5.79 58.88 180 top
R16  5.1kΩ  [R0603]  33.76 10.52 0 top
R17  1.2kΩ  [R1206]  29.34 11.43 0 top
R18  10Ω  [R0805_NEW]  17.41 41.29 0 top
R19  10Ω  [R0805_NEW]  17.46 38.67 0 top
R20  10Ω  [R0805_NEW]  17.46 36.13 0 top
R22  10Ω  [R0805_NEW]  17.46 43.88 180 top
R23  10Ω  [R0805_NEW]  17.4 46.35 180 top
R32  100kΩ  [R0603]  41.34 37.23 180 top
R33  10kΩ  [R0603]  43.05 55.24 90 top
R34  453kΩ  [R0603]  42.08 17.95 180 top
R35  100kΩ  [R0603]  42.08 19.6 180 top
RESET  TS-1088-AR02016  [SW-SMD_L3.9-W3.0-P4.45]  30.1 36.7 270 top
SW2  TS-1088-AR02016  [SW-SMD_L3.9-W3.0-P4.45]  35.69 31.88 0 top
SW3  TS-1088-AR02016  [SW-SMD_L3.9-W3.0-P4.45]  35.69 24.38 0 top
SW4  TS-1088-AR02016  [SW-SMD_L3.9-W3.0-P4.45]  35.69 28.07 0 top
SW5  TS-1088-AR02016  [SW-SMD_L3.9-W3.0-P4.45]  40.64 28.07 270 top
SW6  TS-1088-AR02016  [SW-SMD_L3.9-W3.0-P4.45]  30.86 27.94 90 top
U1  2.4GHz  [BULETM-SMD_ESP32-S3-MINI-1-N8]  32.64 49.15 0 top
U3  ES8388  [QFN-28_L4.0-W4.0-P0.45-BL-EP]  14.1 20.27 0 top
U4  TP4056  [ESOP-8_L4.9-W3.9-P1.27-LS6.0-BL-EP]  30.15 16.45 0 top
U5  ICS-43434  [MIC-SMD_6P-L3.5-W2.7-P0.90-BL]  41.38 34.43 270 top
U6  10uF  [CAP-SMD_BD4.0-L4.3-W4.3-LS5.0-FD]  5.59 16.13 180 top
U8  10uF  [CAP-SMD_BD4.0-L4.3-W4.3-LS5.0-FD]  19.3 25.78 0 top
U9  10uF  [CAP-SMD_BD4.0-L4.3-W4.3-LS5.0-FD]  14.99 29.84 0 top
U10  10uF  [CAP-SMD_BD4.0-L4.3-W4.3-LS5.0-FD]  9.27 28.32 0 top
U11  10uF  [CAP-SMD_BD4.0-L4.3-W4.3-LS5.0-FD]  9.27 23.49 0 top
U12  HS24CG003-ARX  [LCD-SMD_HS24CG003-ARX]  11.94 61.98 0 top
U13  ADS7843E/2K5  [SSOP-16_L4.9-W3.9-P0.64-LS6.0-BL-1]  14.48 57.15 270 top
U14  10uF  [CAP-SMD_BD4.0-L4.3-W4.3-LS5.0-FD]  6.73 55.12 180 top
U15  10uF  [CAP-SMD_BD4.0-L4.3-W4.3-LS5.0-FD]  19.81 51.05 90 top
U16  AP3429AKTTR-G1  [TSOT-23-5_L2.9-W1.6-P0.95-LS2.8-BR]  42.46 12.62 90 top
USB1  TYPE-C 16PIN 2MD(073)  [USB-C-SMD_TYPE-C-6PIN-2MD-073]  31.5 6.22 0 top

## Footprints (pads in the part's own frame, mm; a bottom-side part is the same pattern mirrored in y, then rotated)
AUDIO-SMD_PJ-332A-6A
  oval 1.9x1 hole 1.5x0.6: 1(-4.725,-2.95) 2(-4.725,2.5)
  rect 1.5x1.6 smd: 3(-1.275,-3.6) 4(2.525,3.6) 5(4.225,-3.6) 6(4.725,3.6)
BULETM-SMD_ESP32-S3-MINI-1-N8
  rect 0.8x0.4 smd: 1(-6.975,5.95) 2(-6.975,5.1) 3(-6.975,4.25) 4(-6.975,3.4) 5(-6.975,2.55) 6(-6.975,1.7) 7(-6.975,0.85) 8(-6.975,0) 9(-6.975,-0.85) 10(-6.975,-1.7) 11(-6.975,-2.55) 12(-6.975,-3.4) 13(-6.975,-4.25) 14(-6.975,-5.1) 15(-6.975,-5.95) 31(6.975,-5.95) 32(6.975,-5.1) 33(6.975,-4.25) 34(6.975,-3.4) 35(6.975,-2.55) 36(6.975,-1.7) 37(6.975,-0.85) 38(6.975,0) 39(6.975,0.85) 40(6.975,1.7) 41(6.975,2.55) 42(6.975,3.4) 43(6.975,4.25) 44(6.975,5.1) 45(6.975,5.95)
  rect 0.4x0.8 smd: 16(-5.95,-7.025) 17(-5.1,-7.025) 18(-4.25,-7.025) 19(-3.4,-7.025) 20(-2.55,-7.025) 21(-1.7,-7.025) 22(-0.85,-7.025) 23(0,-7.025) 24(0.85,-7.025) 25(1.7,-7.025) 26(2.55,-7.025) 27(3.4,-7.025) 28(4.25,-7.025) 29(5.1,-7.025) 30(5.95,-7.025) 46(5.95,7.025) 47(5.1,7.025) 48(4.25,7.025) 49(3.4,7.025) 50(2.55,7.025) 51(1.7,7.025) 52(0.85,7.025) 53(0,7.025) 54(-0.85,7.025) 55(-1.7,7.025) 56(-2.55,7.025) 57(-3.4,7.025) 58(-4.25,7.025) 59(-5.1,7.025) 60(-5.95,7.025)
  rect 0.8x0.8 smd: GND(-7,7) GND(-7,-7) GND(7,7) GND(7,-7)
  rect 1.2x1.2 smd: GND(-1.65,1.65) GND(-1.65,0) GND(-1.65,-1.65) GND(0,1.65) GND(0,0) GND(0,-1.65) GND(1.65,1.65) GND(1.65,0) GND(1.65,-1.65)
C0402
  rect 0.79x0.54 smd: 1(-0.545,0) 2(0.545,0)
C0603
  rect 0.8x0.9 smd: 1(-0.7,0) 2(0.7,0)
C0805
  rect 1.41x1.35 smd: 1(-1,0) 2(1,0)
CAP-SMD_BD4.0-L4.3-W4.3-LS5.0-FD
  rect 2.8x1.1 smd: 1(-1.661,0) 2(1.661,0)
CONN-TH_B2B-PH-K-S
  round 1.6 hole 0.9: 1(1,0) 2(-1,0)
ESOP-8_L4.9-W3.9-P1.27-LS6.0-BL-EP
  rect 0.6x1.2 smd: 1(-1.905,-2.909) 2(-0.635,-2.909) 3(0.635,-2.909) 4(1.905,-2.909) 5(1.905,2.909) 6(0.635,2.909) 7(-0.635,2.909) 8(-1.905,2.909)
  rect 3.3x2.4 smd: 9(0,0)
L1008
  rect 1.635x2.16 smd: 1(-1.167,0) 2(1.167,0)
LCD-SMD_HS24CG003-ARX
  rect 0.7x2.5 smd: 1(7.5,0) 2(6.5,0) 3(5.5,0) 4(4.5,0) 5(3.5,0) 6(2.5,0) 7(1.5,0) 8(0.5,0) 9(-0.5,0) 10(-1.5,0) 11(-2.5,0) 12(-3.5,0) 13(-4.5,0) 14(-5.5,0) 15(-6.5,0) 16(-7.5,0)
MIC-SMD_6P-L3.5-W2.7-P0.90-BL
  rect 0.52x0.6 smd: 1(-1.286,-0.9) 2(-0.465,-0.9) 4(-0.465,0.9) 5(-1.286,0.9) 6(-1.286,0)
  custom 0.709x0.71 smd: 3(0.276,-0.452) 3(0.329,0.505) 3(1.234,-0.505) 3(1.286,0.452)
QFN-28_L4.0-W4.0-P0.45-BL-EP
  oval 0.23x0.665 smd: 1(-1.349,-1.931) 2(-0.898,-1.931) 3(-0.449,-1.931) 4(0.002,-1.931) 5(0.452,-1.931) 6(0.901,-1.931) 7(1.351,-1.931) 15(1.351,1.931) 16(0.901,1.931) 17(0.452,1.931) 18(0.002,1.931) 19(-0.449,1.931) 20(-0.898,1.931) 21(-1.349,1.931)
  oval 0.665x0.23 smd: 8(1.931,-1.351) 9(1.931,-0.901) 10(1.931,-0.452) 11(1.931,-0.002) 12(1.931,0.449) 13(1.931,0.898) 14(1.931,1.349) 22(-1.931,1.349) 23(-1.931,0.898) 24(-1.931,0.449) 25(-1.931,-0.002) 26(-1.931,-0.452) 27(-1.931,-0.901) 28(-1.931,-1.351)
  rect 2.4x2.4 smd: 29(0,0)
R0402
  rect 0.566x0.54 smd: 1(-0.433,0) 2(0.433,0)
R0603
  rect 0.806x0.864 smd: 1(-0.753,0) 2(0.753,0)
R0805_NEW
  rect 1.133x1.377 smd: 1(-0.966,0) 2(0.966,0)
R1206
  rect 1.208x1.701 smd: 1(-1.479,0) 2(1.479,0)
SSOP-16_L4.9-W3.9-P0.64-LS6.0-BL-1
  oval 0.4x1.63 smd: 1(-2.223,-2.87) 2(-1.587,-2.87) 3(-0.953,-2.87) 4(-0.318,-2.87) 5(0.318,-2.87) 6(0.953,-2.87) 7(1.587,-2.87) 8(2.223,-2.87) 9(2.223,2.87) 10(1.587,2.87) 11(0.953,2.87) 12(0.318,2.87) 13(-0.318,2.87) 14(-0.953,2.87) 15(-1.587,2.87) 16(-2.223,2.87)
SW-SMD_L3.9-W3.0-P4.45
  rect 1.23x1.36 smd: 1(-2.185,0) 2(2.185,0)
TF-SMD_DS1139-06-08SS4BSR
  rect 0.8x2 smd: 1(3.2,-1.6) 2(2.1,-1.6) 3(1,-1.6) 4(-0.1,-1.6) 5(-1.2,-1.6) 6(-2.3,-1.6) 7(-3.4,-1.6) 8(-4.5,-1.6)
  rect 1.8x2.2 smd: 9(-6.8,4.1) 10(-6.8,-4.1) 11(6.8,-4.1) 12(6.8,4.1)
TSOT-23-5_L2.9-W1.6-P0.95-LS2.8-BR
  rect 1.1x0.7 smd: 1(1.294,-0.951) 2(1.294,-0.001) 3(1.294,0.951) 4(-1.294,0.951) 5(-1.294,-0.949)
USB-C-SMD_TYPE-C-6PIN-2MD-073
  rect 0.55x1.1 smd: 1(-3.2,2.375) 2(-2.4,2.375) 11(2.4,2.375) 12(3.2,2.375)
  rect 0.3x1.1 smd: 3(-1.75,2.375) 4(-1.25,2.375) 5(-0.75,2.375) 6(-0.25,2.375) 7(0.25,2.375) 8(0.75,2.375) 9(1.25,2.375) 10(1.75,2.375)
  oval 1.1x2 hole 0.6x1.5: 13(-4.325,1.825) 14(4.325,1.825)
  oval 1.2x1.8 hole 0.6x1.2: 13(-4.325,-2.375) 14(4.325,-2.375)

## Nets
As in the schematic, except:
GND: BOOT.1 C1.1 C2.1 C3.2 C4.2 C7.1 C8.1 C9.1 C10.2 C11.1 C12.1 C13.1 C14.1 C15.1 C16.2 C17.1 C19.1 C20.1 CARD1.6 CARD1.9 CARD1.10 CARD1.11 CARD1.12 CN1.1 CN2.1 R16.1 R17.1 R32.2 R35.2 RESET.2 SW2.1 SW3.1 SW4.1 SW5.1 SW6.1 U1.1 U1.2 U1.42 U1.43 U1.46 U1.47 U1.48 U1.49 U1.50 U1.51 U1.52 U1.53 U1.54 U1.55 U1.56 U1.57 U1.58 U1.59 U1.60 U1.GND U3.4 U3.13 U3.18 U3.29 U4.1 U4.3 U4.9 U5.3 U6.2 U8.1 U9.2 U10.2 U11.2 U12.1 U12.2 U12.7 U12.15 U13.6 U14.2 U15.2 U16.2 USB1.1 USB1.12 USB1.13 USB1.14
$1N16329: C15.2 R33.1 RESET.1 U1.45
$1N30324: BOOT.2 U1.4

Pads without a net: CN1 2 5 6; U1 22 30 35 36 37 38 39 40 41 44; U3 9 14 15 21 22 23 24 25; U4 8; U12 14; U13 7 8 13; USB1 3 5 8 9 10

## Via types
v1: diameter 0.61, hole 0.305, Top Layer to Bottom Layer, 146 vias

## Routing (per net, layer and track width the routed paths; a pad name or vN(x,y) marks a point on that pad's centre or on a via; arc(x,y) is an arc through that point)
3.3V: length 208.9
  Top Layer w0.23: 13.22,18.29 13.22,18.03 13.21,18.02 ; 13.22,18.29 13.61,18.29 U3.3 ; 13.22,18.29 U3.2
  Top Layer w0.254: 6.76,58.88 7.04,58.59 8.39,58.59 ; C10.1 18.52,54.93 U13.9 ; C10.1 18.98,55.27 18.98,51.2 19.81,50.37 U15.1 ; C10.1 18.82,55.44 17.35,55.44 ; 17.35,55.44 U13.10 ; 17.35,55.44 U13.9 ; R33.2 42.2,56.85 25.15,56.85 24.96,56.66 24.96,55.63 24.98,55.61 24.98,53.93 25.52,53.4 ; 41.08,17.83 41.21,17.83 ; U13.9 17.09,54.67 12.65,54.67 12.17,54.19 10.41,54.19 10.13,54.47 10.13,55.65 9.4,56.39 9.4,57.45 9.57,57.62 9.57,57.77 9.6,57.8 9.6,58.29 9.57,58.32 9.57,58.64 v1(9.02,59.19) C9.2 8.39,58.59 ; v1(10.54,59.3) 11.53,59.3 U13.1 ; R13.1 8.64,17.52 U6.1 8.26,15.11 10.93,15.11 11.44,15.62 12.21,15.62 v1(12.21,17.02) 12.91,17.72 12.92,17.72 13.15,17.96 13.15,17.96 13.21,18.02 U3.2 U3.3 ; 8.39,58.59 U14.1 4.63,51.36 4.63,49.86 3.35,48.58 3.35,44.25 3.52,44.09 4.21,44.09 CARD1.4 ; U3.17 U3.16 15.06,22.26 15.06,22.58 15.28,22.8 v1(15.28,23.75) 15.28,24.97 C4.1 15.6,24.79 19.97,24.79 U8.2 ; 42.77,37.78 42.77,36.69 42.28,36.19 U5.5 42.42,35.58 C14.2 43.61,35.55 43.03,34.97 43.03,34.02 43.61,33.43 43.61,24.2 C20.2 ; v1(12.45,60.71) 12.45,61.97 U12.8 ; 8.64,18.57 R14.1
  Top Layer w0.508: U1.3 23.82,53.4 U15.1 ; U15.1 19.81,47.8 R23.1 18.42,46.3 R22.1 18.42,41.34 R18.2 18.37,38.72 R19.2 R20.2 18.42,34.78 C13.2 20.96,31.39 U8.2 26.11,20.64 37.85,20.64 38.93,19.56 C20.2 ; U15.1 20.79,48.42 20.79,47.23 21.31,46.7 C16.1
  Top Layer w1.016: L1.1 38.88,15.29 C19.2 ; 38.93,19.51 38.93,17.44 40.69,17.44 41.32,18.08 41.38,18.02 C18.2
  Bottom Layer w0.254: v1(12.21,17.02) 12.21,16.51 10.91,15.22 10.43,15.22 10.08,15.56 10.08,18.15 9.91,18.32 9.14,18.32 8.58,18.87 8.58,22.02 7.69,22.91 7.37,22.91 7.03,23.25 7.03,23.74 7.37,24.08 7.85,24.08 8.19,23.74 8.19,23.41 9.58,22.03 13.55,22.03 v1(15.28,23.75) ; v1(9.02,59.19) 10.44,59.19 v1(10.54,59.3) 11.04,59.3 v1(12.45,60.71)
3.7V: length 26.2
  Top Layer w1.016: U16.4 40.44,11.32 40.26,11.14 40.26,10.99 39.79,10.52 37.23,10.52 36.54,11.22 36.54,15.48 35.52,16.49 35.52,18.24 35.1,18.67 34.78,18.67 C11.2 34.09,19.36 32.06,19.36 ; U16.4 42.06,10.77 C17.2 CN2.2 ; U16.4 42.88,12.7 43.08,12.7 43.47,13.09 43.47,13.91
5V: length 26.3
  Top Layer w0.254: 34.02,9.14 33.91,9.03 ; 29.1,8.09 29.08,8.1 29.08,8.58 USB1.2 29.1,8.09 ; 29.1,8.09 29.1,8 30.12,6.98 30.2,6.98 ; 29.1,8.09 30.2,6.98 ; C12.2 35.43,11.57 35.43,10.05 35.33,9.94 ; 35.07,9.69 34.92,9.54 34.42,9.54 ; 30.2,6.98 32.88,6.98 33.9,8 USB1.11 ; 30.2,6.98 30.35,6.83 32.79,6.83 33.91,7.96 33.91,8.61
  Top Layer w0.508: USB1.11 34.02,8.72 34.02,9.32 34.38,9.69 35.09,9.69 35.33,9.92 35.33,11.12 35.09,11.36 34.27,11.36 34.04,11.59 34.04,12.32
  Top Layer w1.016: U4.4 32.75,12.84 C12.2
GND: length 97.7
  Top Layer w0.254: v1(20.95,62) 20.95,59.72 21.69,58.98 21.69,58.5 21.35,58.16 20.66,58.16 C10.2 19.81,55.54 v1(19.81,52.71) ; U1.GND v1(34.29,47.5) ; U12.7 13.81,62.35 13.81,63.34 13.97,63.5 17.9,63.5 18.07,63.34 18.07,62.35 U12.2 v1(19.44,61.98) ; U3.29 15.14,20.27 15.42,20.55 15.42,20.88 15.66,21.11 15.98,21.11 U3.13 ; v1(39.61,52.55) 42.16,52.55 C15.1 ; U5.3 40.77,34.31 40.24,34.31 40.19,34.36 40.06,34.36 39.89,34.53 39.89,36.09 40.59,36.78 40.59,37.23 ; U5.3 40.93,33.87 40.9,33.85 40.9,33.45 40.93,33.42 40.93,33.25 U5.3 41.15,33.2 41.18,33.17 41.58,33.17 41.61,33.2 41.78,33.2 v1(41.83,33.15) ; U5.3 41.83,34.16 U5.3 ; BOOT.1 RESET.2 30.86,34.52 v1(33.5,31.88) ; v1(10.17,56.73) 10.7,56.2 U13.6 ; USB1.14 35.25,8.05 34.7,8.6 ; U1.2 v1(25.66,55.1) ; v1(10.33,50.37) 14.07,50.37 17.28,47.16 17.28,45.55 17.17,45.45 17.17,44.85 17.34,44.69 17.34,43.08 17.17,42.91 15.81,42.91 14.5,44.22 7.47,44.22 5.83,45.87 4.63,45.87 ; U3.18 14.11,23.67 v1(14.19,23.75) 14.26,23.82 v1(14.26,25.04) ; USB1.13 27.75,8.05 USB1.1 ; U1.GND v1(30.99,47.5) ; v1(3.93,16.13) 4.9,16.13 ; v1(14.11,19.53) U3.4 14.11,17.83 v1(13.3,17.02) ; 13.27,15.62 v1(13.3,15.62)
  Bottom Layer w0.254: v1(20.95,62) 20.93,61.98 v1(19.44,61.98)
  vias: v1(2.11,50.37) v1(2.13,36.77) v1(5.07,55.12) v1(5.44,61.98) v1(9.02,58.05) v1(10.33,36.77) v1(10.93,28.32) v1(10.93,23.49) v1(12.7,26.2) v1(15.4,26.42) v1(16.65,29.84) v1(16.91,34.36) v1(17.64,25.78) v1(21.97,48.17) v1(25.64,56.15) v1(26.69,56.17) v1(27.54,56.17) v1(27.86,11.43) v1(28.25,13.54) v1(28.39,56.17) v1(29.24,56.17) v1(30.09,56.17) v1(30.15,16.45) v1(30.48,13.54) v1(30.94,56.17) v1(30.99,50.8) v1(30.99,49.15) v1(31.23,25.75) v1(31.79,56.17) v1(32.64,56.17) v1(32.64,50.8) v1(32.64,49.15) v1(32.64,47.5) v1(33.01,10.52) v1(33.49,56.17) v1(33.5,28.07) v1(33.5,24.38) v1(34.15,17.3) v1(34.16,14.92) v1(34.34,56.17) v1(34.29,50.8) v1(34.29,49.15) v1(35.19,56.17) v1(36.04,56.17) v1(36.89,56.17) v1(36.9,19.56) v1(36.88,17.44) v1(37.74,56.17) v1(38.59,56.17) v1(39.64,56.15) v1(39.61,53.4) v1(39.98,9.19) v1(40.44,37.25) v1(40.64,30.25) v1(41.32,19.6) v1(42.46,13.91) v1(43.61,34.54)
ADCVREF: length 10
  Top Layer w0.254: U3.19 13.66,23.22 13.51,23.36 13.51,24.84 13.24,25.11 C8.2 10.41,27.39 8.54,27.39 U10.1
AMP_CE: length 30.7
  Top Layer w0.254: v1(11.25,20.11) 11.55,19.82 U3.26
  Bottom Layer w0.254: v1(26.69,42.12) 26.69,36.98 16.57,26.86 16.57,23.21 14.32,20.96 12.1,20.96 v1(11.25,20.11)
ASDOUT: length 27.5
  Bottom Layer w0.254: v1(18.34,18.41) 18.34,28.13 27.54,37.33 v1(27.54,42.12)
BCLK: length 60.3
  Bottom Layer w0.254: v1(14.86,16.06) 16.63,17.83 18.58,17.83 18.92,18.17 18.92,18.66 18.8,18.78 18.8,28.08 28.39,37.67 v1(28.39,42.12) 28.41,42.12 29,42.71 30.19,42.71 30.55,43.06 30.62,43.06 30.71,43.15 37.57,43.15 38.67,44.26 38.67,46.14 39.22,46.69 40,46.69 42.32,44.37 42.32,35.33 42.28,35.29 v1(42.28,34.9)
C: length 14.5
  Bottom Layer w0.254: v1(37.74,42.12) 37.29,41.67 37.29,31.63 37.87,31.05 v1(37.87,28.07)
CHRG: length 24.9
  Bottom Layer w0.254: v1(29.52,19.36) 28.32,20.55 28.32,34.91 31.44,38.03 31.44,40.97 32.51,42.04
  vias: v1(32.64,42.12)
D: length 18.4
  Bottom Layer w0.254: v1(36.89,42.12) 36.58,41.81 36.58,25.75 v1(37.95,24.38)
DN: length 38.9
  Top Layer w0.254: v1(31.9,7.57) 31.75,7.73 USB1.7
  Bottom Layer w0.254: v1(31.9,7.57) 31.9,19.57 29.61,21.86 29.61,34.69 32.51,37.59 32.51,39.45 v1(35.19,42.12)
DP: length 38.8
  Top Layer w0.254: USB1.6 31.25,7.7 v1(31.11,7.57)
  Bottom Layer w0.254: v1(31.11,7.57) 31.11,18.86 31.37,19.12 31.37,19.6 29.16,21.81 29.16,34.74 32.16,37.74 32.16,39.94 v1(34.34,42.12)
DSDIN: length 32.2
  Bottom Layer w0.254: v1(16.26,16.08) 17.65,17.47 18.73,17.47 19.28,18.03 19.28,18.8 19.15,18.93 19.15,27.93 29.24,38.02 v1(29.24,42.12)
FB: length 12.1
  Top Layer w0.254: 42.83,15.85 42.83,15.87 ; 42.83,15.87 C18.1 ; 42.83,15.87 43.08,15.87 44.45,14.49 44.45,12.37 U16.5 ; 42.83,15.87 42.83,15.97 ; 42.83,15.97 R34.1 ; 42.83,15.97 C18.1 ; R34.1 42.78,17.9 C18.1 ; R34.1 42.83,19.98
I2C_CLK: length 35.6
  Top Layer w0.254: U3.28 9.86,18.92 v1(9.52,19.26)
  Bottom Layer w0.254: v1(25.66,43.2) 25.66,36.46 16.22,27.01 16.22,23.36 14.17,21.31 10.52,21.31 10.11,20.9 10.11,20.59 9.52,20 v1(9.52,19.26)
I2C_DAT: length 38.7
  Top Layer w0.254: U3.27 10.61,19.37 9.52,20.45 v1(9.52,20.83)
  Bottom Layer w0.254: v1(25.66,44.05) 25.38,44.05 25.02,43.69 25.02,36.32 15.7,27 15.16,27 13.67,25.51 13.67,24.61 13.95,24.33 15.52,24.33 15.86,23.99 15.86,23.51 14.02,21.67 10.37,21.67 v1(9.52,20.83)
L: length 14.2
  Bottom Layer w0.254: v1(31.2,30.12) 32.92,31.84 32.92,32.12 33.26,32.46 33.54,32.46 35.81,34.74 35.81,41.9 v1(36.04,42.12)
LCD_CS: length 28.7
  Bottom Layer w0.254: v1(25.66,48.3) 25.66,48.32 26.25,48.91 26.25,49.25 26.6,49.61 26.6,52.09 22.05,56.65 22.05,59.13 21.49,59.68 19.31,59.68 17.02,61.98 16.98,61.98 16.04,62.92 10.2,62.92 9.26,61.98 v1(8.44,61.98)
LCD_DC: length 25.1
  Bottom Layer w0.254: v1(25.66,49.15) 25.66,49.17 26.25,49.76 26.25,51.94 25.91,52.28 25.7,52.28 21.46,56.52 21.46,58.27 21.69,58.5 21.69,58.98 21.35,59.33 19.13,59.33 15.9,62.56 11.2,62.56 10.97,62.33 v1(10.44,62.33)
LCD_RST: length 31.4
  Bottom Layer w0.254: v1(25.66,47.45) 25.66,47.47 26.25,48.06 26.25,48.4 26.6,48.76 26.6,49.11 26.96,49.46 26.96,52.24 22.4,56.79 22.4,59.28 21.64,60.04 19.46,60.04 16.23,63.27 8.73,63.27 v1(7.44,61.98)
LOUT: length 23.2
  Top Layer w0.254: 22.26,16.3 17.25,11.29 17.25,8.61 17.51,8.35 17.51,6.62 17.34,6.46 15.51,6.46 15.35,6.62 15.35,8.35 13.19,10.51 12.37,10.51 11.59,11.29 9.23,11.29
LRCK: length 57.5
  Bottom Layer w0.254: 30.19,42.12 30.36,42.29 30.36,42.37 30.7,42.71 30.77,42.71 30.86,42.8 37.71,42.8 39.03,44.11 39.03,45.99 39.37,46.33 39.86,46.33 41.96,44.23 41.96,35.48 41.62,35.14 40.72,35.14 v1(40.48,34.9) ; 30.19,42.12 v1(30.09,42.12) ; 30.19,42.12 30.03,41.96 ; v1(17.65,16.08) 17.83,16.08 19.64,17.88 19.64,18.95 19.51,19.08 19.51,27.76 30.05,38.3 30.05,41.94
MCLK: length 42.9
  Bottom Layer w0.254: v1(10.67,15.8) 11.62,16.76 11.62,17.26 12.96,18.59 14.27,17.27 14.27,15.82 14.62,15.48 17.88,15.48 19.99,17.59 19.99,27.74 30.94,38.69 v1(30.94,42.12)
MISO: length 43.2
  Top Layer w0.254: CARD1.7 13.41,46.97 v1(16.49,43.88) ; v1(25.66,46.6) 24.01,46.6 v1(24,46.59)
  Bottom Layer w0.254: v1(16.5,56.83) 17.74,55.6 18.42,55.6 18.56,55.74 19.29,55.74 24.28,50.74 24.28,46.87 v1(24,46.59) 22.66,45.25 22.57,45.25 18.02,40.71 16.3,40.71 15.96,41.05 15.96,41.53 16.49,42.07 v1(16.49,43.88)
MOSI: length 45.8
  Top Layer w0.254: v1(23.7,50.04) 25.62,50.04 v1(25.66,50) ; CARD1.3 15.17,42.57 R18.1
  Bottom Layer w0.254: v1(23.7,50.04) 23.7,48.45 v1(16.54,41.29) ; v1(25.66,50) 25.66,50.02 25.08,50.61 25.08,50.95 17.93,58.1 v1(16.5,58.1) 16.5,58.68 13.21,61.98 v1(11.44,61.98)
PENIRQ: length 14.2
  Bottom Layer w0.254: v1(18.18,56.18) 19.35,56.18 24.64,50.89 24.64,46.8 25.66,45.77 v1(25.66,45.75)
R: length 19.1
  Bottom Layer w0.254: v1(40.64,25.88) 39.61,26.91 39.61,42.29 40.2,42.87 40.2,43.44 39.61,44.02 v1(39.61,44.05)
ROUT: length 10.3
  Top Layer w0.254: CN1.3 16.43,11.04 17.51,12.12 17.51,13.66 20.13,16.28
SCLK: length 49.1
  Top Layer w0.254: 10,63.54 9.98,63.54 9.47,63.03 9.47,63.01 10,63.54 ; 10,63.54 10.35,63.88 19.59,63.88 20.14,63.33 20.14,60.41 19.25,60.41 v1(18.24,59.39) 17.37,59.39 U13.16
  Bottom Layer w0.254: v1(4.63,44.77) 9.4,49.53 9.4,56.84 8.43,57.8 8.43,59.43 9.4,60.4 v1(9.4,61.34) ; v1(18.24,59.39) 18.24,58.3 25.66,50.87 v1(25.66,50.85)
SD: length 12.6
  Top Layer w0.254: v1(41.38,35.72) 41.38,36.52 R32.1
  Bottom Layer w0.254: v1(41.38,35.72) 41.38,43.99 v1(39.61,45.75)
SD_CS: length 24.8
  Top Layer w0.254: v1(16.53,38.67) 13.74,41.47 4.63,41.47
  Bottom Layer w0.254: v1(25.66,44.9) 22.72,44.9 R19.1
STDBY: length 25.5
  Bottom Layer w0.254: v1(30.79,19.36) 28.8,21.34 28.8,34.89 31.8,37.89 31.8,40.43 v1(33.49,42.12)
TCH_CS: length 12.7
  Top Layer w0.254: U13.15 21.1,58.74 v1(21.11,58.74)
  Bottom Layer w0.254: v1(25.66,51.7) 21.11,56.26 v1(21.11,58.74)
U: length 12
  Bottom Layer w0.254: v1(37.87,31.88) 38.1,32.1 38.1,41.27 39.61,42.79 v1(39.61,43.2)
VMID: length 24.7
  Top Layer w0.254: 13.33,27.4 12.61,28.12 12.61,28.99 12.45,29.15 6.09,29.15 5.93,28.99 5.93,27.66 6.92,26.67 10.54,26.67 12.15,25.06 12.15,24.6 12.31,24.43 12.78,24.43 13.16,24.05 13.16,23.22 13.21,23.17 U3.20 ; 13.33,27.4 C7.2 ; 13.33,27.4 U9.1
VREF: length 14.4
  Top Layer w0.254: v1(16.79,19.17) 16.65,19.31 16.65,19.53 16.36,19.82 U3.10
  Bottom Layer w0.254: v1(7.61,23.49) 8.94,22.16 8.94,19.01 9.28,18.67 9.77,18.67 10.04,18.95 14.35,18.95 14.57,19.17 v1(16.79,19.17)
WS: length 10
  Bottom Layer w0.254: v1(40.48,35.72) 41.02,36.26 41.02,43.49 v1(39.61,44.9)
$1N3464: length 2.8
  Top Layer w0.254: 12.76,18.34 12.34,18.34 R6.1
$1N3611: length 3
  Top Layer w0.254: R7.2 16.85,16.94 16.8,16.99 16.8,17.34 16.64,17.5 16.29,17.5 U3.7
$1N3650: length 1.5
  Top Layer w0.23: R8.1 14.56,17.22 U3.5
$1N3734: length 2
  Top Layer w0.254: R9.1 15.47,17.72 15.29,17.72 15.01,18.01 U3.6
$1N3736: length 1.6
  Top Layer w0.254: U3.8 16.54,18.41 R10.1
$1N3967: length 3.9
  Top Layer w0.23: C21.2 17.89,20.27 U3.11
  Top Layer w0.254: U3.11 16.09,20.21 16.42,20.21 16.43,20.2 C21.2
$1N4008: length 3.6
  Top Layer w0.23: 16.8,21.28 16.8,21.02 16.49,20.72 16.24,20.72
  Top Layer w0.254: U3.12 16.24,20.72 16.29,20.77 16.42,20.77 16.65,21 16.65,21.13 16.8,21.28 C22.2
$1N4170: length 4.1
  Top Layer w0.254: 20.13,20.03 C21.1 19.96,18.38 R11.2 20.13,20.03
$1N6804: length 9.8
  Top Layer w0.254: 14.44,61.59 14.07,61.22 14.07,60.23 13.72,59.88 10.1,59.88 9.96,59.74 9.96,57.83 10.79,56.99 11.45,56.99 U13.5
$1N6810: length 8.7
  Top Layer w0.254: U12.3 17.44,60.96 13.95,57.47 11.23,57.47
$1N6817: length 10.9
  Top Layer w0.254: 16.44,60.71 U12.4 ; 16.44,60.71 13.83,58.1 ; 16.44,60.71 16.44,60.6 13.94,58.1 13.83,58.1 ; 13.83,58.1 U13.3
$1N6824: length 5.9
  Top Layer w0.254: U13.2 13.39,58.74 15.44,60.79 U12.5
$1N7337: length 3.3
  Top Layer w0.254: 4.83,58.88 4.44,59.27 U12.16
$1N7731: length 5.4
  Top Layer w0.254: 34.52,10.52 33.42,9.43 30.48,9.43 30.25,9.19 USB1.4
$1N8164: length 2.6
  Top Layer w1.016: U4.2 29.52,12.73 R17.2
$1N10270: length 13.6
  Top Layer w0.254: R20.1 12.26,40.37 CARD1.1
$1N10384: length 12.5
  Top Layer w0.254: CARD1.8 14.72,48.07 R23.2
$1N16329: length 29.5
  Top Layer w0.254: RESET.1 32.66,41.44 40.13,41.44 43.6,44.92 43.6,52.16 43.05,52.71 C15.2 R33.1 42.45,55.1 U1.45
$1N17107: length 3.4
  Top Layer w1.016: L1.2 40.21,12.68 41.45,13.91
$1N20602: length 9
  Top Layer w0.254: 20.99,19.5 20.99,21.4 C22.1 19.89,22.36 19.89,21.39 20.07,21.21 20.72,21.21 20.94,20.99 20.94,19.55 20.99,19.5 ; 20.99,19.5 22.26,18.23
$1N30324: length 15.8
  Top Layer w0.254: BOOT.2 25.4,41.19 24.96,41.63 24.96,43.49 24,44.45 24,45.77 23.11,46.66 23.11,50.28 23.46,50.62 23.59,50.62 25.15,52.18 25.29,52.18 U1.4

## Copper pours and planes (outline as drawn; the poured copper is in the pictures)
GND on Bottom Layer: -0.76,65.66 45.85,65.66 45.85,1.52 -0.76,1.52
